# EAGLE design Body_PCB_v1 (EAGLE 7.2.0)

## Sheet 1 of 2
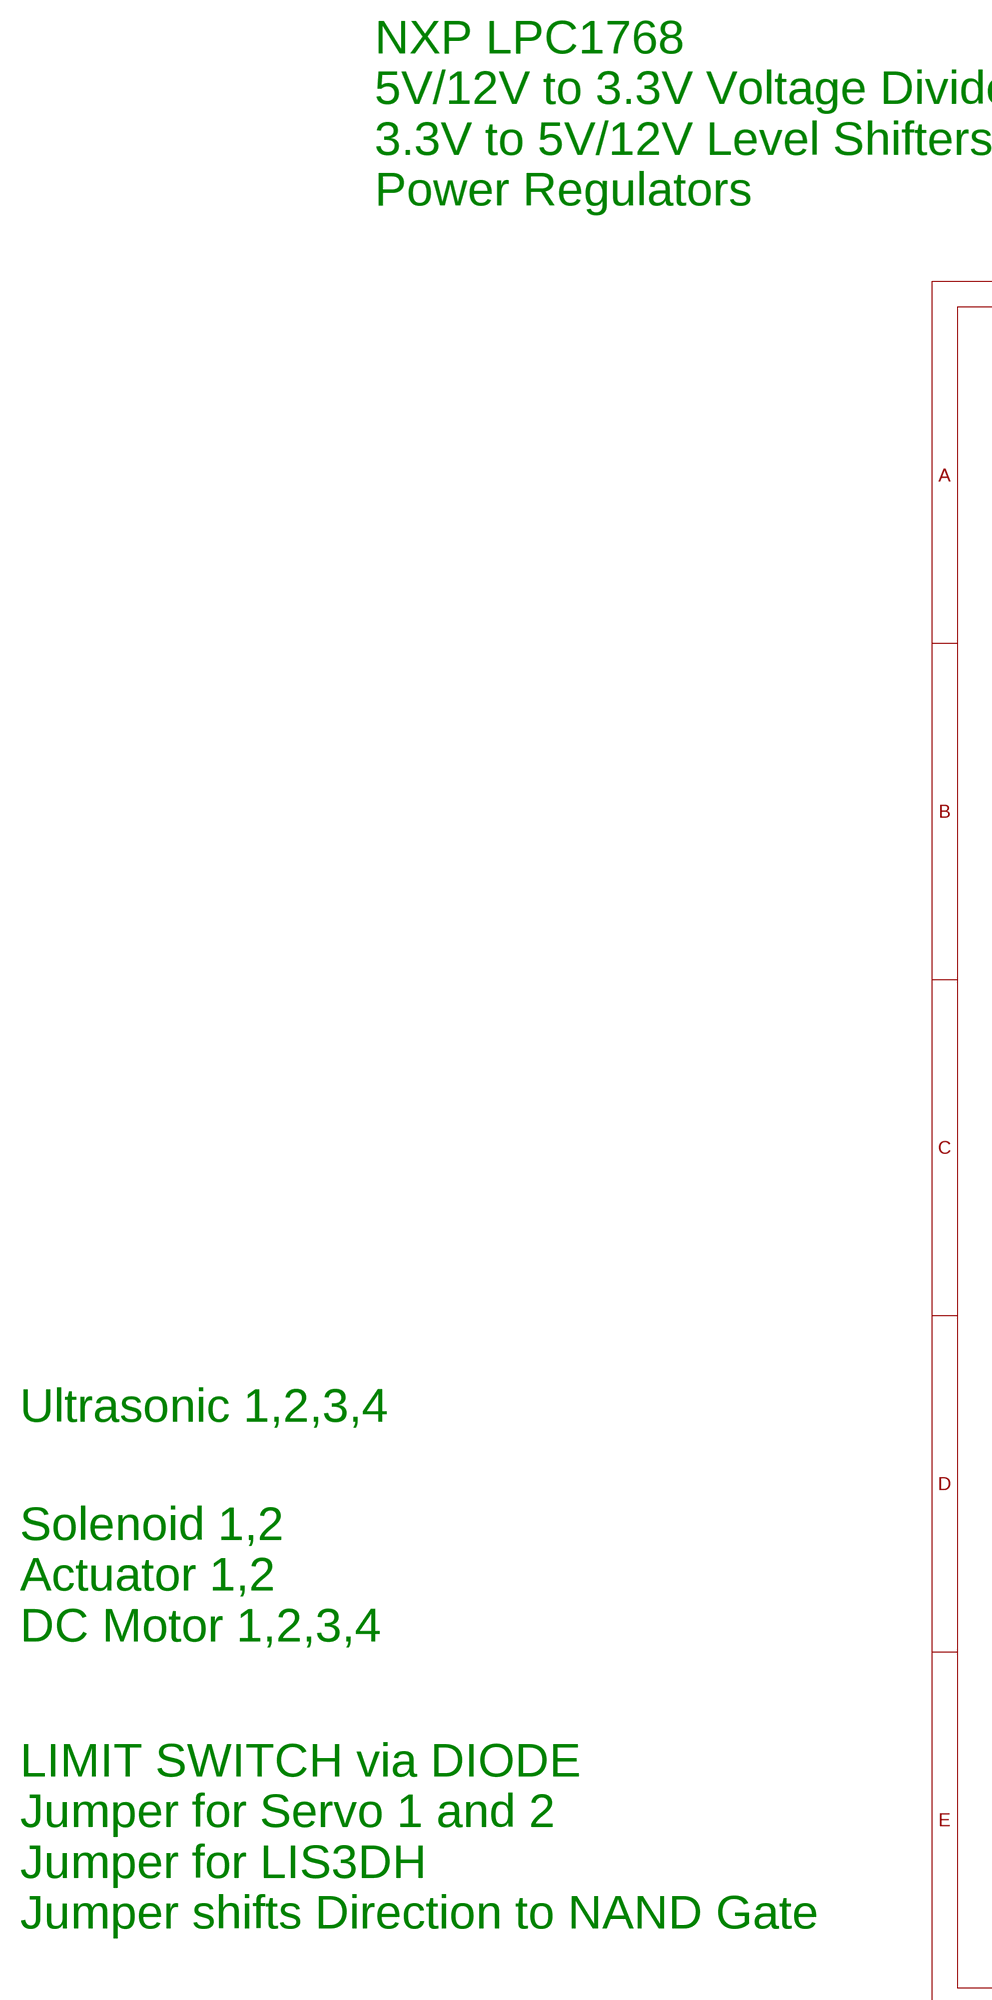
[diagram p0: schematic, sheet 1, part 1 of 2]
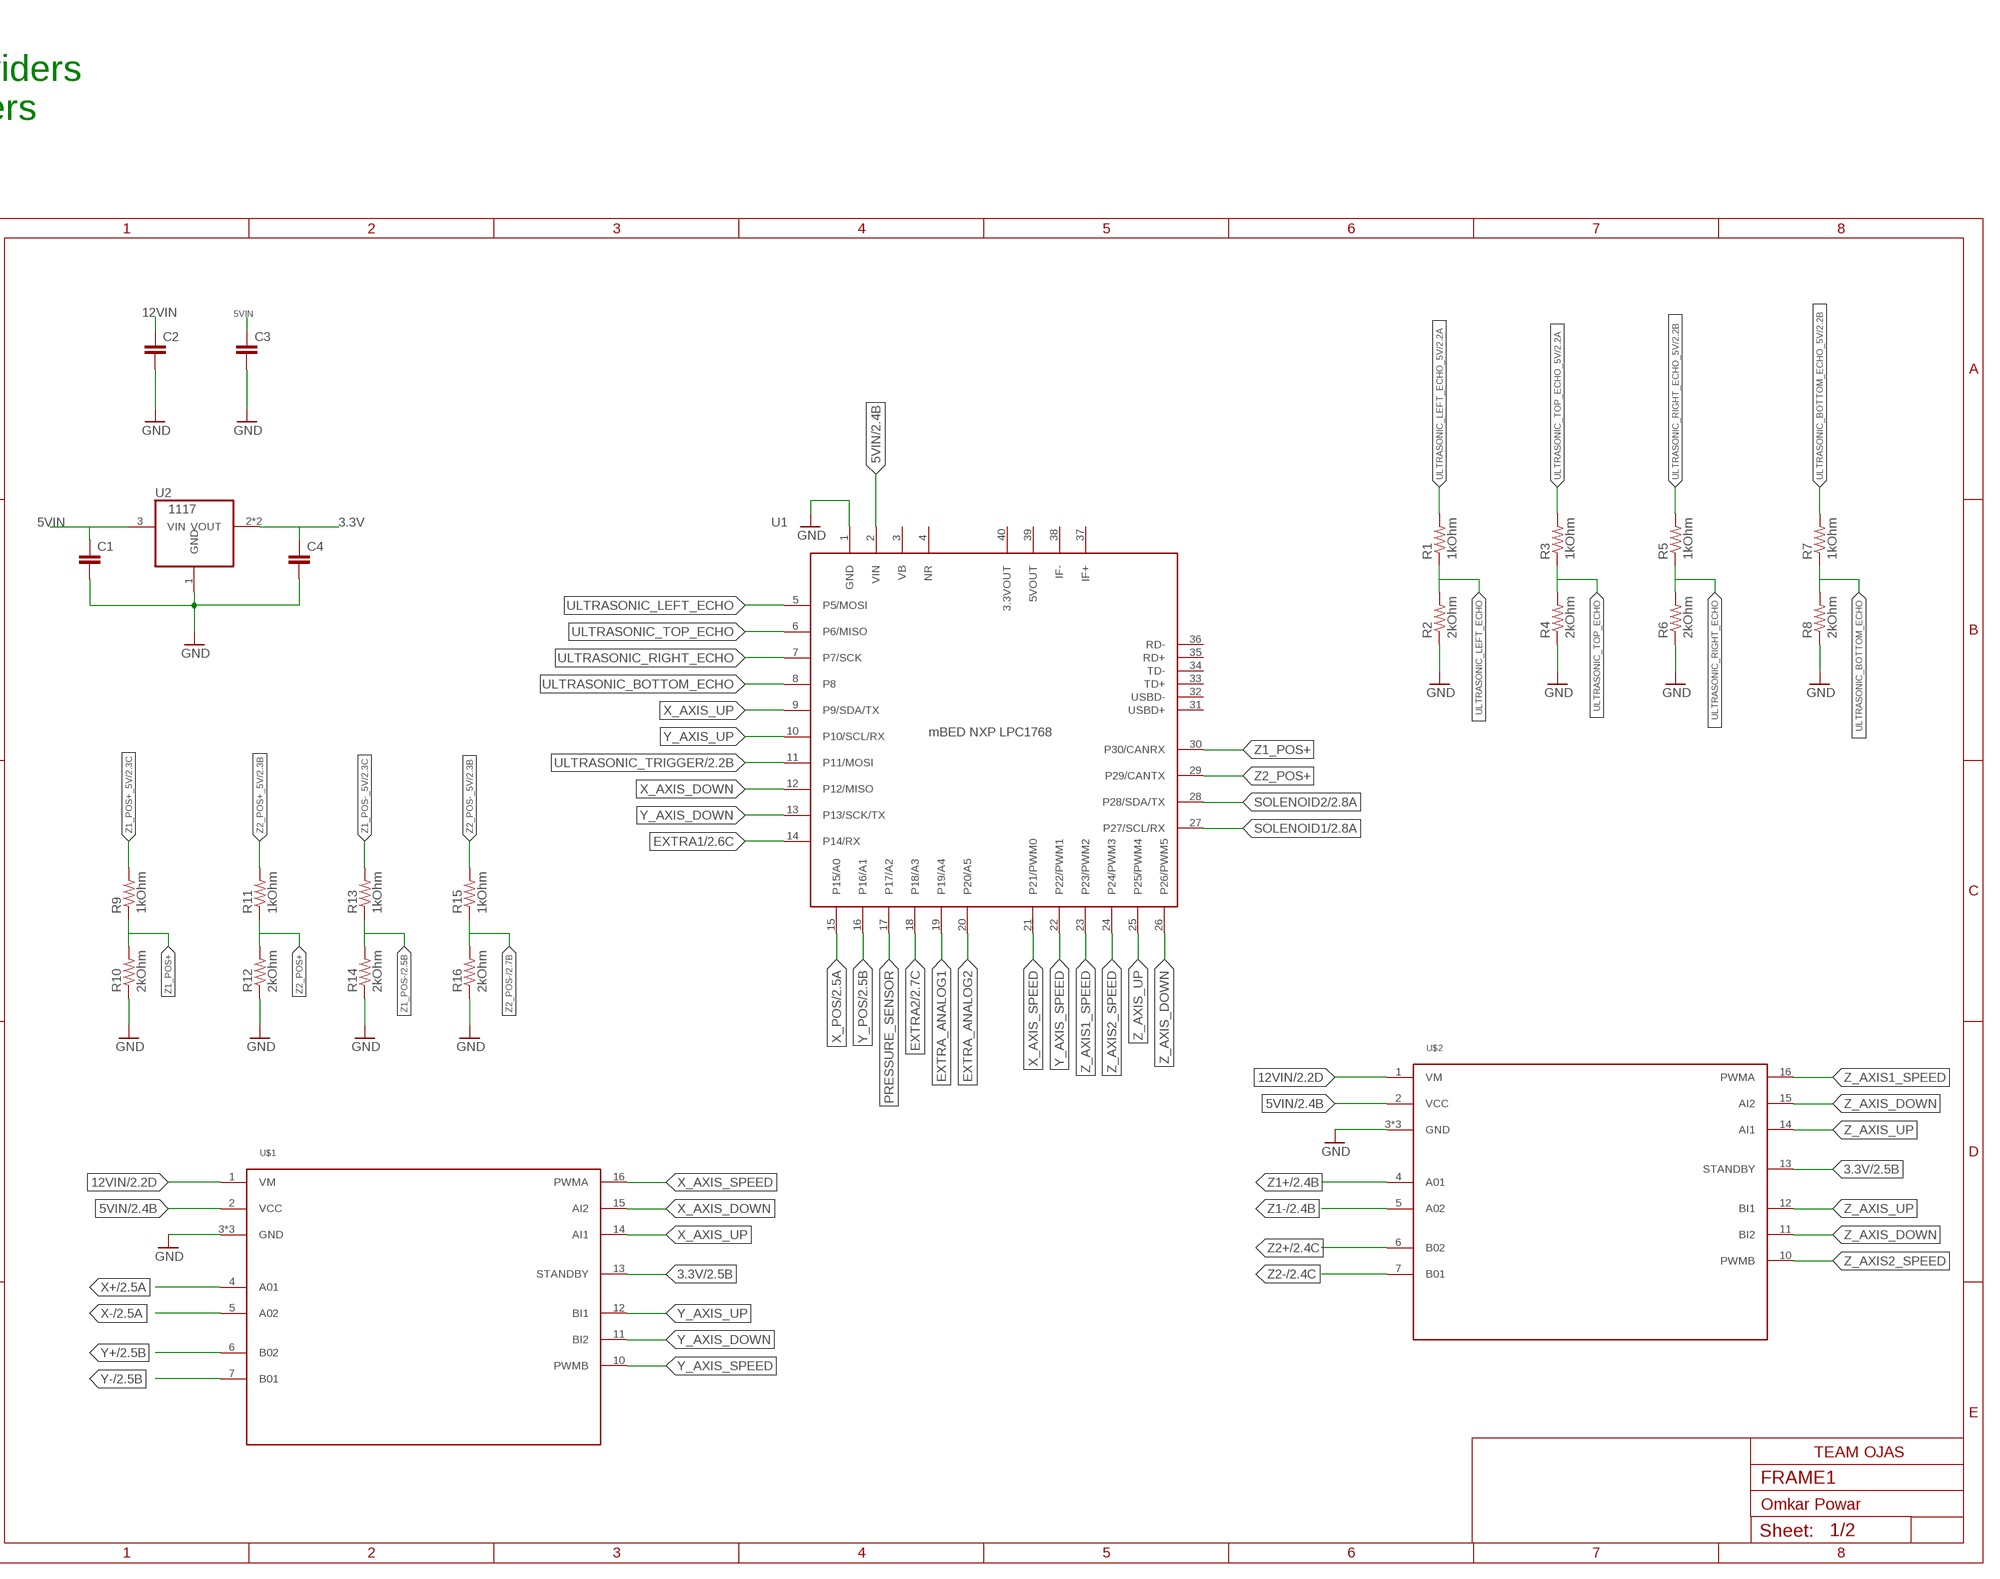
[diagram p1: schematic, sheet 1, part 2 of 2]

### Parts
C1  C1206  [1206]
C2  C1206  [1206]
C3  C1206  [1206]
C4  C1206  [1206]
R1  1kOhm  R0805  [0805]
R2  2kOhm  R0805  [0805]
R3  1kOhm  R0805  [0805]
R4  2kOhm  R0805  [0805]
R5  1kOhm  R0805  [0805]
R6  2kOhm  R0805  [0805]
R7  1kOhm  R0805  [0805]
R8  2kOhm  R0805  [0805]
R9  1kOhm  R0805  [0805]
R10  2kOhm  R0805  [0805]
R11  1kOhm  R0805  [0805]
R12  2kOhm  R0805  [0805]
R13  1kOhm  R0805  [0805]
R14  2kOhm  R0805  [0805]
R15  1kOhm  R0805  [0805]
R16  2kOhm  R0805  [0805]
U1  MBED_NXP_LPC1768  [40_PDIP]
U2  1117  [SOT223]
U$1  TB6612FNG  [TB6612FNG_DRIVER]
U$2  TB6612FNG  [TB6612FNG_DRIVER]

### Nets
3.3V: C4.1 U2.2(VOUT) U2.4(VOUT) U$1.13(STANDBY) U$2.13(STANDBY) ; also sheet 2
5VIN: C1.1 C3.1 U1.2(VIN) U2.3(VIN) U$1.2(VCC) U$2.2(VCC) ; also sheet 2
12VIN: C2.1 U$1.1(VM) U$2.1(VM) ; also sheet 2
EXTRA1: U1.14(P14/RX) ; also sheet 2
EXTRA2: U1.18(P18/A3) ; also sheet 2
EXTRA_ANALOG1: U1.19(P19/A4)
EXTRA_ANALOG2: U1.20(P20/A5)
GND: C1.2 C2.2 C3.2 C4.2 R2.P$1 R4.P$1 R6.P$1 R8.P$1 R10.P$1 R12.P$1 R14.P$1 R16.P$1 U1.1(GND) U2.1(GND) U$1.3(GND) U$1.8(GND) U$1.9(GND) U$2.3(GND) U$2.8(GND) U$2.9(GND) ; also sheet 2
PRESSURE_SENSOR: U1.17(P17/A2)
SOLENOID1: U1.27(P27/SCL/RX) ; also sheet 2
SOLENOID2: U1.28(P28/SDA/TX) ; also sheet 2
ULTRASONIC_BOTTOM_ECHO: R7.P$1 R8.P$2 U1.8
ULTRASONIC_BOTTOM_ECHO_5V: R7.P$2 ; also sheet 2
ULTRASONIC_LEFT_ECHO: R1.P$1 R2.P$2 U1.5(P5/MOSI)
ULTRASONIC_LEFT_ECHO_5V: R1.P$2 ; also sheet 2
ULTRASONIC_RIGHT_ECHO: R5.P$1 R6.P$2 U1.7(P7/SCK)
ULTRASONIC_RIGHT_ECHO_5V: R5.P$2 ; also sheet 2
ULTRASONIC_TOP_ECHO: R3.P$1 R4.P$2 U1.6(P6/MISO)
ULTRASONIC_TOP_ECHO_5V: R3.P$2 ; also sheet 2
ULTRASONIC_TRIGGER: U1.11(P11/MOSI) ; also sheet 2
X+: U$1.4(A01) ; also sheet 2
X-: U$1.5(A02) ; also sheet 2
X_AXIS_DOWN: U1.12(P12/MISO) U$1.15(AI2)
X_AXIS_SPEED: U1.21(P21/PWM0) U$1.16(PWMA)
X_AXIS_UP: U1.9(P9/SDA/TX) U$1.14(AI1)
X_POS: U1.15(P15/A0) ; also sheet 2
Y+: U$1.6(B02) ; also sheet 2
Y-: U$1.7(B01) ; also sheet 2
Y_AXIS_DOWN: U1.13(P13/SCK/TX) U$1.11(BI2)
Y_AXIS_SPEED: U1.22(P22/PWM1) U$1.10(PWMB)
Y_AXIS_UP: U1.10(P10/SCL/RX) U$1.12(BI1)
Y_POS: U1.16(P16/A1) ; also sheet 2
Z1+: U$2.4(A01) ; also sheet 2
Z1-: U$2.5(A02) ; also sheet 2
Z1_POS+: R9.P$1 R10.P$2 U1.30(P30/CANRX)
Z1_POS+_5V: R9.P$2 ; also sheet 2
Z1_POS-: R13.P$1 R14.P$2 ; also sheet 2
Z1_POS-_5V: R13.P$2 ; also sheet 2
Z2+: U$2.6(B02) ; also sheet 2
Z2-: U$2.7(B01) ; also sheet 2
Z2_POS+: R11.P$1 R12.P$2 U1.29(P29/CANTX)
Z2_POS+_5V: R11.P$2 ; also sheet 2
Z2_POS-: R15.P$1 R16.P$2 ; also sheet 2
Z2_POS-_5V: R15.P$2 ; also sheet 2
Z_AXIS1_SPEED: U1.23(P23/PWM2) U$2.16(PWMA)
Z_AXIS2_SPEED: U1.24(P24/PWM3) U$2.10(PWMB)
Z_AXIS_DOWN: U1.26(P26/PWM5) U$2.11(BI2) U$2.15(AI2)
Z_AXIS_UP: U1.25(P25/PWM4) U$2.12(BI1) U$2.14(AI1)
Unconnected: U1.3(VB) U1.4(NR) U1.31(USBD+) U1.32(USBD-) U1.33(TD+) U1.34(TD-) U1.35(RD+) U1.36(RD-) U1.37(IF+) U1.38(IF-) U1.39(5VOUT) U1.40(3.3VOUT)

### Notes on the sheet
- NXP LPC1768
  5V/12V to 3.3V Voltage Dividers
  3.3V to 5V/12V Level Shifters
  Power Regulators
- Ultrasonic 1,2,3,4
- Solenoid 1,2
  Actuator 1,2
  DC Motor 1,2,3,4
- LIMIT SWITCH via DIODE
  Jumper for Servo 1 and 2
  Jumper for LIS3DH
  Jumper shifts Direction to NAND Gate

## Sheet 2 of 2
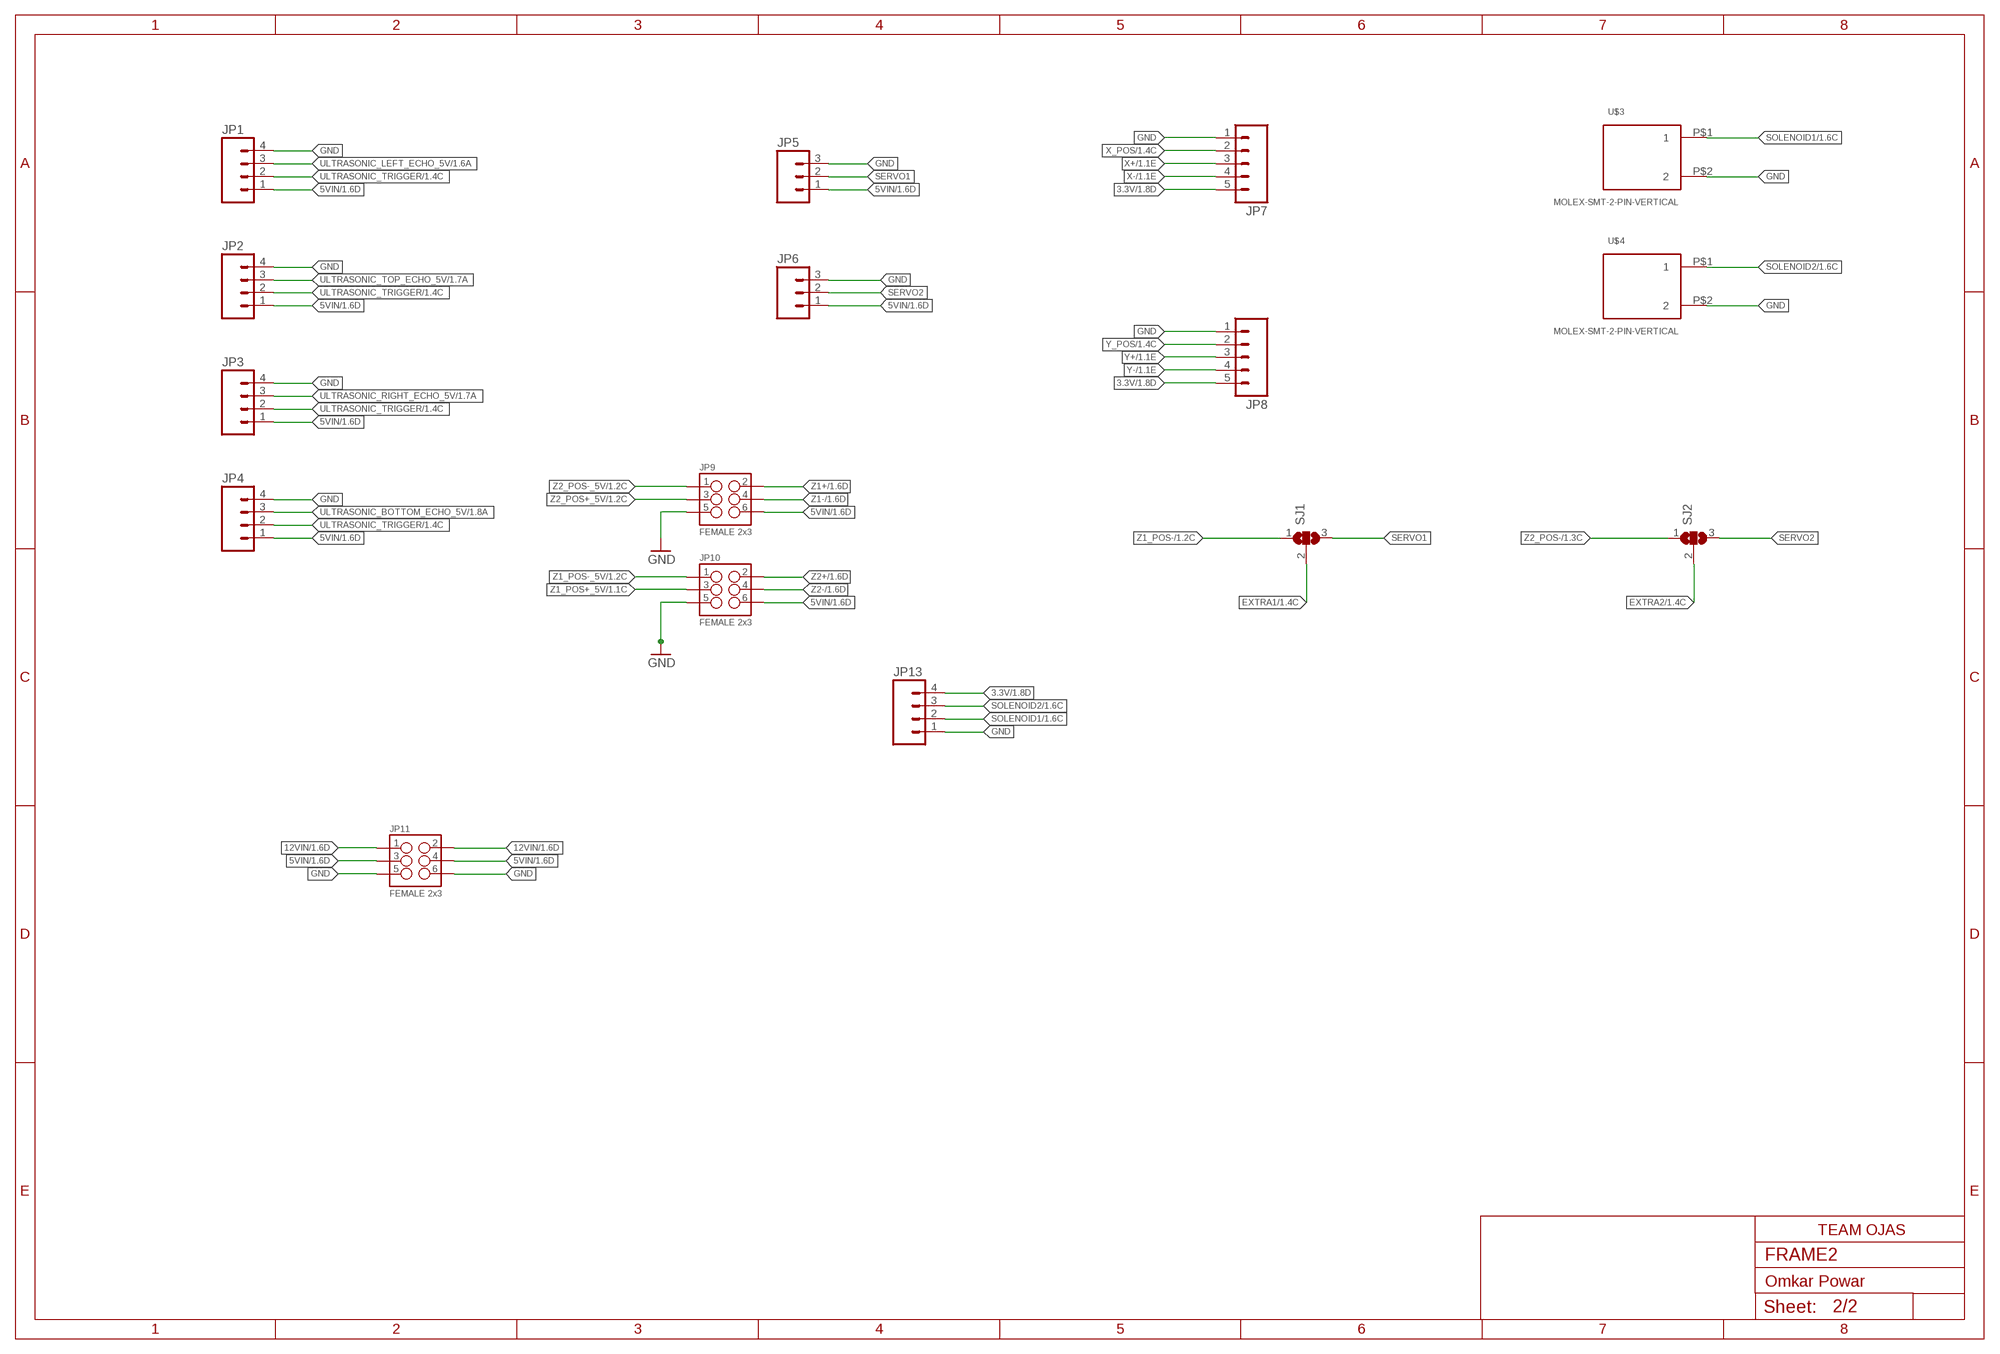
[diagram p2: schematic, sheet 2]

### Parts
JP1  M04PTH  [1X04]
JP2  M04PTH  [1X04]
JP3  M04PTH  [1X04]
JP4  M04PTH  [1X04]
JP5  M03PTH  [1X03]
JP6  M03PTH  [1X03]
JP7  M05PTH  [1X05]
JP8  M05PTH  [1X05]
JP9  FEMALE 2x3  M03X2FEMALE  [2X3]
JP10  FEMALE 2x3  M03X2FEMALE  [2X3]
JP11  FEMALE 2x3  M03X2FEMALE  [2X3]
JP13  M04PTH  [1X04]
SJ1  SJ2W  [SJ_2]
SJ2  SJ2W  [SJ_2]
U$3  MOLEX-SMT-2-PIN-VERTICAL  [430450215]
U$4  MOLEX-SMT-2-PIN-VERTICAL  [430450215]

### Nets
3.3V: JP7.5 JP8.5 JP13.4 ; also sheet 1
5VIN: JP1.1 JP2.1 JP3.1 JP4.1 JP5.1 JP6.1 JP9.6 JP10.6 JP11.3 JP11.4 ; also sheet 1
12VIN: JP11.1 JP11.2 ; also sheet 1
EXTRA1: SJ1.2 ; also sheet 1
EXTRA2: SJ2.2 ; also sheet 1
GND: JP1.4 JP2.4 JP3.4 JP4.4 JP5.3 JP6.3 JP7.1 JP8.1 JP9.5 JP10.5 JP11.5 JP11.6 JP13.1 U$3.P$2 U$4.P$2 ; also sheet 1
SERVO1: JP5.2 SJ1.3
SERVO2: JP6.2 SJ2.3
SOLENOID1: JP13.2 U$3.P$1 ; also sheet 1
SOLENOID2: JP13.3 U$4.P$1 ; also sheet 1
ULTRASONIC_BOTTOM_ECHO_5V: JP4.3 ; also sheet 1
ULTRASONIC_LEFT_ECHO_5V: JP1.3 ; also sheet 1
ULTRASONIC_RIGHT_ECHO_5V: JP3.3 ; also sheet 1
ULTRASONIC_TOP_ECHO_5V: JP2.3 ; also sheet 1
ULTRASONIC_TRIGGER: JP1.2 JP2.2 JP3.2 JP4.2 ; also sheet 1
X+: JP7.3 ; also sheet 1
X-: JP7.4 ; also sheet 1
X_POS: JP7.2 ; also sheet 1
Y+: JP8.3 ; also sheet 1
Y-: JP8.4 ; also sheet 1
Y_POS: JP8.2 ; also sheet 1
Z1+: JP9.2 ; also sheet 1
Z1-: JP9.4 ; also sheet 1
Z1_POS+_5V: JP10.3 ; also sheet 1
Z1_POS-: SJ1.1 ; also sheet 1
Z1_POS-_5V: JP10.1 ; also sheet 1
Z2+: JP10.2 ; also sheet 1
Z2-: JP10.4 ; also sheet 1
Z2_POS+_5V: JP9.3 ; also sheet 1
Z2_POS-: SJ2.1 ; also sheet 1
Z2_POS-_5V: JP9.1 ; also sheet 1

## Library data of the parts
C1-C4 = Team_Ojas_OVPowar:C
JP1-JP4 JP13 = SparkFun-Connectors:M04: Header 4 Standard 4-pin 0.1" header. Use with straight break away headers (SKU : PRT-00116), right angle break away headers (PRT-00553), swiss pins (PRT-00743), machine pins (PRT-00117), and female headers (PRT-00115). Molex polarized connector foot print use with SKU : PRT-08231 with associated crimp pins and housings. 1MM SMD Version SKU: PRT-10208
JP5 JP6 = SparkFun-Connectors:M03: Header 3 Standard 3-pin 0.1" header. Use with straight break away headers (SKU : PRT-00116), right angle break away headers (PRT-00553), swiss pins (PRT-00743), machine pins (PRT-00117), and female headers (PRT-00115). Molex polarized connector foot print use with SKU : PRT-08232 with associated crimp pins and housings.
JP7 JP8 = SparkFun-Connectors:M05: Header 5 Standard 5-pin 0.1" header. Use with straight break away headers (SKU : PRT-00116), right angle break away headers (PRT-00553), swiss pins (PRT-00743), machine pins (PRT-00117), and female headers (PRT-00115). Molex polarized connector foot print use with SKU : PRT-08230 with associated crimp pins and housings.
JP9-JP11 = SparkFun-Connectors:M03X2: 2x3 .1" header. Shrouded, with keying- CONN-10681 SMT- CONN-11415 Pogo pins- HW-11044; PROD_ID: CONN-11566
R1-R16 = Team_Ojas_OVPowar:R
SJ1 SJ2 = jumper:SJ2W: SMD solder JUMPER
U1 = Team_Ojas_OVPowar:MBED_NXP_LPC1768
U2 = Carnot_AfterMarket_v2.2:1117
U$1 U$2 = Team_Ojas_OVPowar:TB6612FNG
U$3 U$4 = Team_Ojas_OVPowar:MOLEX-SMT-2-PIN-VERTICAL

## Board
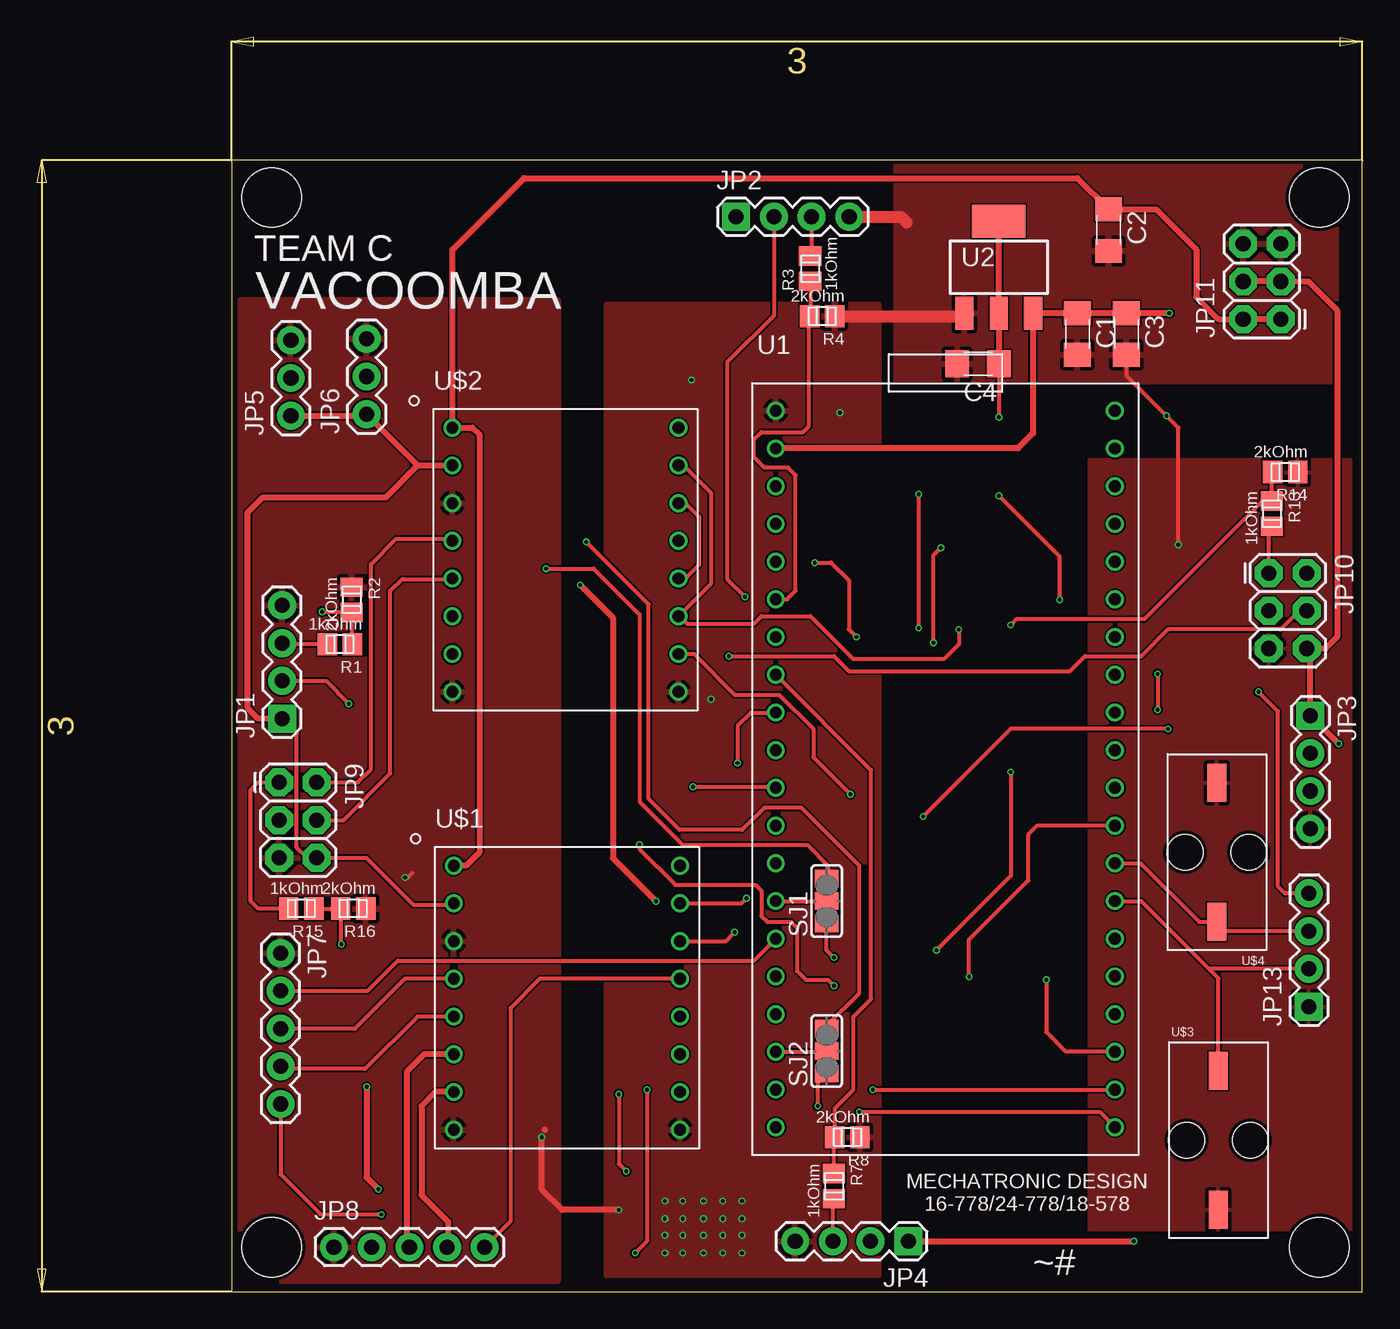
[diagram p3: board, top side]
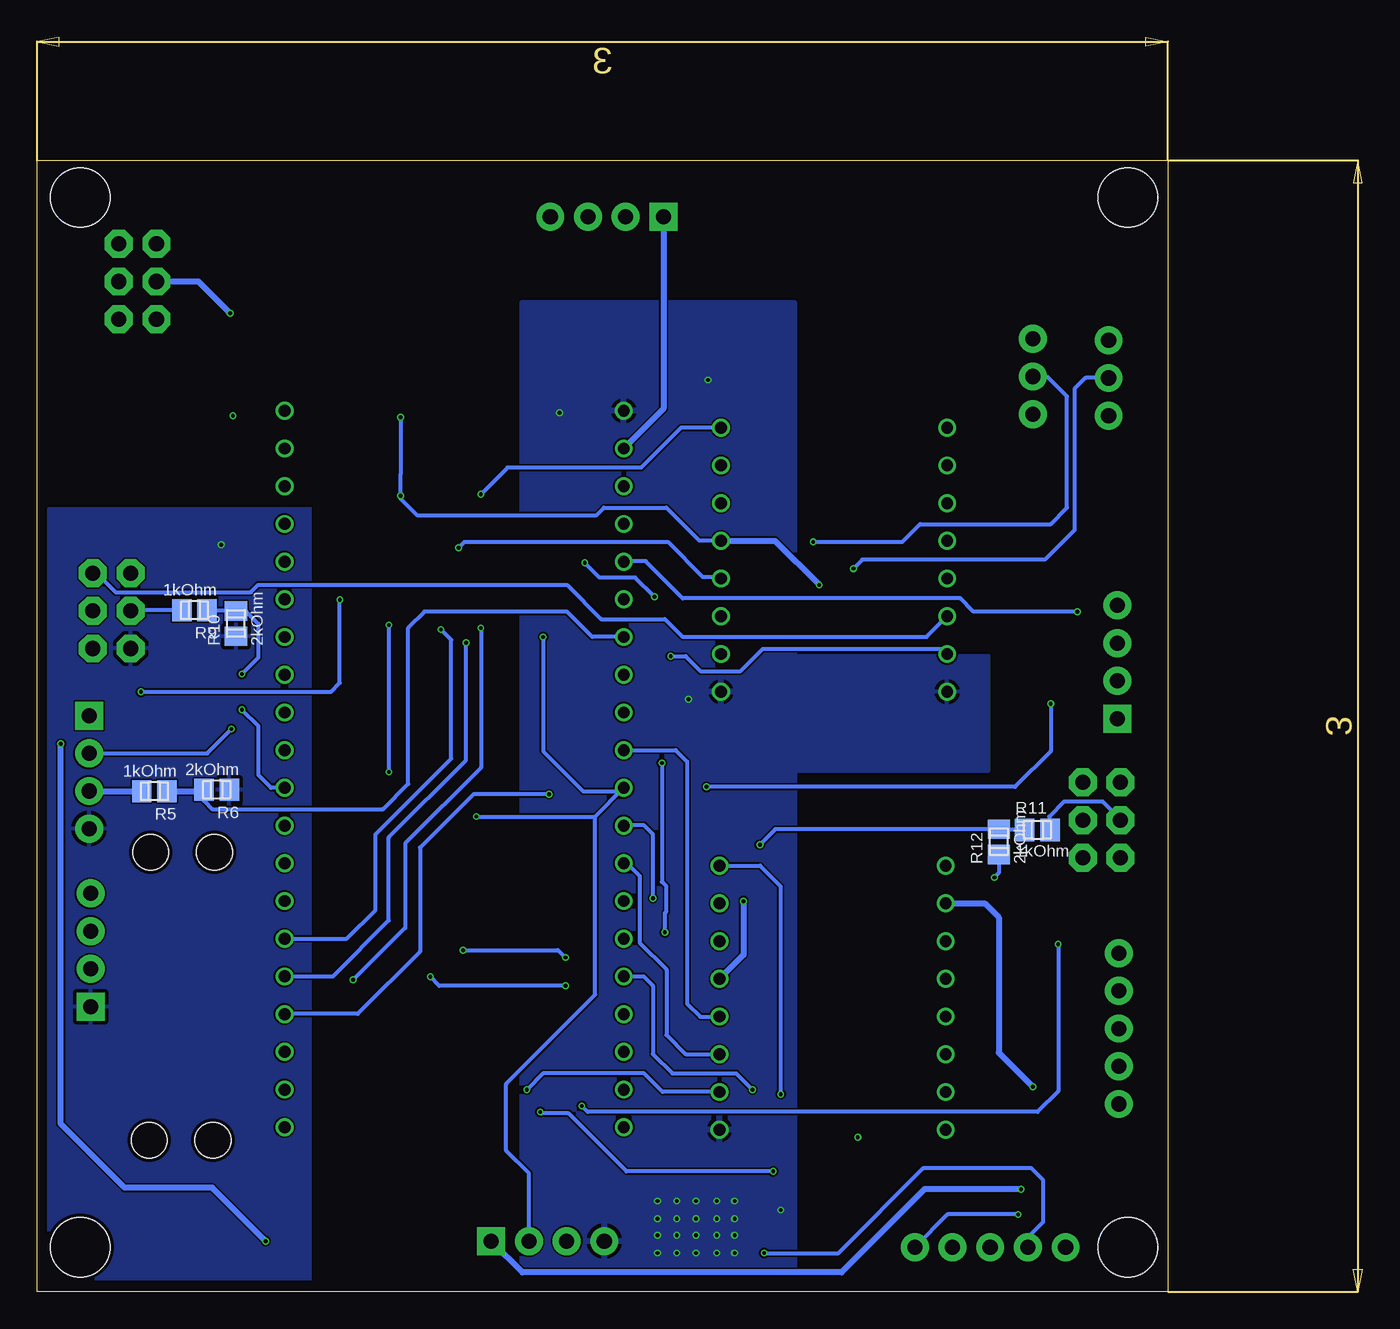
[diagram p4: board, bottom side, seen from below]

Size 76.2 x 76.2 mm. Coordinates in mm from the lower left corner, seen from the top.
Outline: 0,0 76.2,0 76.2,76.2 0,76.2 0,0
Copper layers (1*16): Top 0.035mm / dielectric 1.5mm / Bottom 0.035mm
Design rules "Carnot_syrma": minimum track width 0.1mm, minimum drill 0.2mm, track to track 0.12mm, track to pad 0.12mm, pad to pad 0.12mm, via to via 0.35mm, smd to smd 0.23mm, copper to edge 0.25mm, drill to drill 0.2mm, minimum pad ring 6mil, minimum via ring 4mil, stop-mask expansion 0.05mm, vias tented up to drill 0mil, thermal gap 10mil
Holes 4 mm at 2.7,73.7 73.3,73.7 2.7,3 73.3,3

### Footprints (pad centres in the part's own frame; a part is rotated, then mirrored left to right if it is on the bottom)
1206 = smd 1.6 x 1.8: 1 -1.4,0; 2 1.4,0
1X04 = drill 1.016 pad 1.88 square: 1 0,0 | drill 1.016 pad 1.88: 2 2.54,0; 3 5.08,0; 4 7.62,0
1X03 = drill 1.016 pad 1.88: 1 0,0; 2 2.54,0; 3 5.08,0
1X05 = drill 1.016 pad 1.88: 1 0,0; 2 2.54,0; 3 5.08,0; 4 7.62,0; 5 10.16,0
2X3 = drill 1.016 pad 1.88 octagon: 1 0,0; 2 0,2.54; 3 2.54,0; 4 2.54,2.54; 5 5.08,0; 6 5.08,2.54
0805 = smd 1.3 x 1.5: P$1 -0.85,0; P$2 0.85,0
SJ_2 = smd 1.168 x 1.6: 1 -1.524,0; 2 0,0; 3 1.524,0
40_PDIP = drill 0.8: 1 -11.43,24.13; 2 -11.43,21.59; 3 -11.43,19.05; 4 -11.43,16.51; 5 -11.43,13.97; 6 -11.43,11.43; 7 -11.43,8.89; 8 -11.43,6.35; 9 -11.43,3.81; 10 -11.43,1.27; 11 -11.43,-1.27; 12 -11.43,-3.81; 13 -11.43,-6.35; 14 -11.43,-8.89; 15 -11.43,-11.43; 16 -11.43,-13.97; 17 -11.43,-16.51; 18 -11.43,-19.05; 19 -11.43,-21.59; 20 -11.43,-24.13; 21 11.43,-24.13; 22 11.43,-21.59; 23 11.43,-19.05; 24 11.43,-16.51; 25 11.43,-13.97; 26 11.43,-11.43; 27 11.43,-8.89; 28 11.43,-6.35; 29 11.43,-3.81; 30 11.43,-1.27; 31 11.43,1.27; 32 11.43,3.81; 33 11.43,6.35; 34 11.43,8.89; 35 11.43,11.43; 36 11.43,13.97; 37 11.43,16.51; 38 11.43,19.05; 39 11.43,21.59; 40 11.43,24.13
SOT223 = smd 1.219 x 2.235: 1 -2.311,-3.099; 2 0,-3.099; 3 2.311,-3.099 | smd 3.6 x 2.2: 4 0,3.099
TB6612FNG_DRIVER = drill 0.8: 1 -7.62,8.89; 2 -7.62,6.35; 3 -7.62,3.81; 4 -7.62,1.27; 5 -7.62,-1.27; 6 -7.62,-3.81; 7 -7.62,-6.35; 8 -7.62,-8.89; 9 7.62,-8.89; 10 7.62,-6.35; 11 7.62,-3.81; 12 7.62,-1.27; 13 7.62,1.27; 14 7.62,3.81; 15 7.62,6.35; 16 7.62,8.89
430450215 = smd 1.27 x 2.54: P$1 0,4.68; P$2 0,-4.68 | hole 2.41: -2.15,0; 2.15,0

### Placement (x,y rotation side)
C1  57,64.5 270 top
C2  59.1,71.5 270 top
C3  60.3,64.5 270 top
C4  50.3,62.5 180 top
JP1  3.4,38.6 90 top
JP2  34,72.4 0 top
JP3  72.7,38.8 270 top
JP4  45.6,3.4 180 top
JP5  4,59 90 top
JP6  9.1,59.1 90 top
JP7  3.3,22.8 270 top
JP8  6.9,3 0 top
JP9  3.2,34.3 270 top
JP10  69.9,48.4 270 top
JP11  70.7,65.5 90 top
JP13  72.6,19.2 90 top
R1  7.3,43.6 180 top
R2  8.1,46.6 270 top
R3  39,68.9 90 top
R4  39.8,65.7 180 top
R5  68.3,33.7 180 bottom
R6  64.1,33.8 180 bottom
R7  40.6,7.1 270 top
R8  41.5,10.4 180 top
R9  65.6,45.9 180 bottom
R10  62.8,45 90 bottom
R11  8.8,31.1 0 bottom
R12  11.4,30.3 90 bottom
R13  70.1,52.4 270 top
R14  71,55.2 180 top
R15  4.7,25.8 180 top
R16  8.2,25.8 180 top
SJ1  40.1,26.3 90 top
SJ2  40.1,16.2 90 top
U1  48.1,35.2 0 top
U2  51.7,69 0 top
U$1  22.6,19.8 0 top
U$2  22.5,49.3 0 top
U$3  66.5,10.2 0 top
U$4  66.4,29.6 180 top

### Tracks (layer width: path | path; a pad name or v marks a point on that pad's centre or on a via)
3.3V  (via drill 0.25)
  Top 0.254: JP7.5 3.3,7.9 6,5.2 v10.1,5.2 | U$1.13 20.77,21.07 18.8,19.1 18.8,4.74 JP8.5 | C4.1 v51.7,58.9 | JP13.4 70.98,26.82 70.5,27.3 70.5,39.1 v69.2,40.4 | v55.8,46.6 55.8,49.5 v51.7,53.6
  Top 0.406: U2.4 U2.2 C4.1 | v23.5,47.6 25.7,45.4 25.7,29.2 v28.6,26.3
  Bottom 0.254: v10.1,5.2 14.86,5.2 JP8.5 | v51.7,58.9 51.7,55.1 v51.7,53.6 51.7,53.4 50.6,52.3 38.5,52.3 38,52.8 33.8,52.8 31.6,50.6 30.15,50.6 U$2.13 | v69.2,40.4 56.4,40.4 55.8,41 v55.8,46.6
  Bottom 0.406: U$2.13 26.47,50.57 v23.5,47.6 | v28.6,26.3 28.6,22.69 U$1.13
5VIN  (via drill 0.25)
  Top 0.254: C1.1 | JP9.6 9.08,29.22 12.25,26.05 14.88,26.05 U$1.2 | 5.18,29.22 5.08,29.22 4.4,29.9 4.4,37.6 JP1.1
  Top 0.406: JP11.4 JP11.3 72.56,68.04 74.5,66.1 74.5,44.1 73.7,43.3 72.46,43.3 JP10.6 72.7,43.06 JP3.1 v74.6,36.9 | JP5.1 9,59 JP6.1 12.55,55.65 | v63.2,65.9 C3.1 C1.1 | C1.1 U2.3 54.01,57.81 53,56.8 U1.2 | JP4.1 v60.8,3.4 | v9.1,13.8 9.1,7.7 v9.9,6.9 | 12.55,55.65 U$2.2 | JP1.1 1.8,38.6 1.1,39.3 1.1,52.5 2.1,53.5 10.4,53.5 12.55,55.65 | JP9.6 5.18,29.22
  Bottom 0.406: JP11.4 65.34,68.04 v63.2,65.9 | U$1.2 12.35,26.15 11.4,25.2 11.4,16.1 v9.1,13.8 | v9.9,6.9 16.4,6.9 22,1.3 43.5,1.3 JP4.1 | JP2.1 34,59.46 U1.2 | v60.8,3.4 64.4,7 70.3,7 74.6,11.3 v74.6,36.9
12VIN
  Top 0.406: JP11.1 JP11.2 66.5,65.5 65,67 65,70.2 62.3,72.9 C2.1 57,75 19.7,75 14.88,70.18 U$2.1 16.21,58.19 16.7,57.7 16.7,29.6 15.8,28.7 U$1.1
EXTRA1
  Top 0.254: U1.14 SJ1.2
EXTRA2
  Top 0.254: U1.18 40.05,16.15 SJ2.2
GND  (via drill 0.25)
  Top 0.254: v11.7,27.9 11.9,27.9 12.2,28.2 | C3.2 60.3,61.7 v63,59 63.8,58.2 v63.8,50.3
  Top 0.406: 21.11,10.91 21.1,10.9 | v26.1,5.5 22.3,5.5 20.9,6.9 v20.9,10.4
  Top 0.813: R4.P$1 49.19,65.7 U2.1 | JP2.4 45.1,72.4 45.5,72
  Bottom 0.254: R12.P$1 11.4,28.2 v11.7,27.9
  other vias: 32.3,39.9 41,59.2 31,61.4 29.2,2.6 30.4,2.6 31.8,2.6 33.1,2.6 34.4,2.6 29.2,3.8 30.4,3.8 31.8,3.8 33.1,3.8 34.4,3.8 29.2,4.9 30.4,4.9 31.8,4.9 33.1,4.9 34.4,4.9 29.2,6.1 30.4,6.1 31.8,6.1 33.1,6.1 34.4,6.1
  pour Top: 44.8,78.9 74.4,78.9 74.4,61.3 44.8,61.3
  pour Top: 22,66.8 22,0.7 0.6,0.7 0.6,66.8
  pour Top: 25.3,66.5 43.6,66.5 43.6,1.1 25.3,1.1
  pour Bottom: 57.8,52.7 75.4,52.7 75.4,0.9 57.8,0.9
  pour Top: 75.4,56 57.8,56 57.8,4.2 75.4,4.2
  pour Bottom: 12.1,42.8 33.4,42.8 33.4,35.1 12.1,35.1
  pour Bottom: 43.5,66.6 25.2,66.6 25.2,1.2 43.5,1.2
SERVO1  (via drill 0.25)
  Top 0.254: v21.2,48.7 24.4,48.7 27.5,45.6 27.5,33 30.4,30.1 38.8,30.1 40.2,28.7 40.2,27.92 SJ1.3
  Bottom 0.254: JP5.2 5.56,61.54 6.3,60.8 6.3,51.3 8.3,49.3 20.6,49.3 v21.2,48.7
SERVO2  (via drill 0.25)
  Top 0.254: SJ2.3 40.1,17.9 42.3,20.1 42.3,28.7 38.4,32.6 35.9,32.6 34.4,31.1 30.2,31.1 28.1,33.2 28.1,46.3 v23.9,50.5
  Bottom 0.254: v23.9,50.5 17.9,50.5 16.7,51.7 7.9,51.7 6.8,52.8 6.8,60.3 8.1,61.6 9.06,61.6 JP6.2
SOLENOID1
  Top 0.254: U1.27 61.29,26.31 65.86,21.74 | JP13.2 65.86,21.74 | U$3.P$1 66.5,21.1 65.86,21.74
SOLENOID2
  Top 0.254: U1.28 61.25,28.85 65.2,24.9 66.38,24.9 U$4.P$1 67.04,24.28 JP13.3
ULTRASONIC_BOTTOM_ECHO
  Top 0.254: R7.P$1 40.6,10.35 R8.P$2 40.65,12.35 41.9,13.6 41.9,18.5 43.1,19.7 43.1,35.12 U1.8
ULTRASONIC_BOTTOM_ECHO_5V
  Top 0.254: JP4.3 40.52,6.17 R7.P$2
ULTRASONIC_LEFT_ECHO  (via drill 0.25)
  Top 0.254: R1.P$1 8.1,43.65 R2.P$2 6.15,45.75 v6.1,45.8
  Bottom 0.254: v6.1,45.8 13.1,45.8 14,46.7 32.7,46.7 35.2,49.2 36.64,49.2 U1.5
ULTRASONIC_LEFT_ECHO_5V
  Top 0.254: R1.P$2 3.48,43.6 JP1.3
ULTRASONIC_RIGHT_ECHO
  Bottom 0.254: R6.P$2 64.95,33.05 64.4,32.5 52.9,32.5 51.2,34.2 51.2,44.7 50.1,45.8 40.5,45.8 38.8,44.1 U1.7
  Bottom 0.406: R5.P$1 65.05,33.7 R6.P$2
ULTRASONIC_RIGHT_ECHO_5V
  Bottom 0.406: JP3.3 69.17,33.72 R5.P$2
ULTRASONIC_TOP_ECHO
  Top 0.254: R3.P$1 39,66.2 | 39,66.2 39,65.75 R4.P$2 | U1.6 37.43,46.63 38,47.2 38,55 37.5,55.5 35.9,55.5 35.2,56.2 35.2,57.4 35.7,57.9 38.5,57.9 38.9,58.3 38.9,66.1 39,66.2
ULTRASONIC_TOP_ECHO_5V
  Top 0.254: JP2.3 39.08,69.83 R3.P$2
ULTRASONIC_TRIGGER  (via drill 0.25)
  Top 0.254: JP1.2 6.36,41.14 v7.9,39.6 | v31.1,34 36.6,34 U1.11 | v63.1,37.9 52.5,37.9 v46.6,32 | JP2.2 36.54,65.74 33.4,62.6 33.4,48 v34.6,46.8 34.4,47 | v39.3,49.1 40.4,49.1 41.6,47.9 41.6,44.6 v42.1,44.1
  Bottom 0.254: v7.9,39.6 7.9,36.4 10.3,34 v31.1,34 | JP4.2 43.06,7.96 44.6,9.5 44.6,14 38.6,20 38.6,32 | 36.7,33.9 U1.11 | 38.6,32 U1.11 | 36.6,34 U1.11 | JP3.2 64.74,36.26 v63.1,37.9 | v46.6,32 38.6,32 | v34.6,46.8 35.9,48.1 38.3,48.1 v39.3,49.1 | v42.1,44.1 42.1,36.4 39.4,33.7 36.9,33.7 U1.11
X+
  Top 0.254: U$1.4 11.67,21.07 8.3,17.7 3.32,17.7 JP7.3
X-
  Top 0.254: U$1.5 12.53,18.53 9,15 3.48,15 JP7.4
X_AXIS_DOWN  (via drill 0.25)
  Top 0.254: U$1.15 34.35,26.15 v34.7,26.5
  Bottom 0.254: v34.7,26.5 34.7,30.8 35.3,31.4 U1.12
X_AXIS_SPEED  (via drill 0.25)
  Top 0.254: v26.1,13.3 26.1,8.6 v26.6,8.1 | v42.3,12.1 58.5,12.1 U1.21
  Bottom 0.254: U$1.16 27.49,28.69 26.1,27.3 v26.1,13.3 | v26.6,8.1 36.5,8.1 40.4,12 42.2,12 v42.3,12.1
X_AXIS_UP  (via drill 0.25)
  Top 0.254: U$1.14 33.31,23.61 v33.9,24.2 | U1.9 35,39 34.1,38.1 v34.1,35.6
  Bottom 0.254: v33.9,24.2 33.9,25.5 33.8,25.6 33.8,27.3 34.1,27.6 v34.1,35.6
X_POS
  Top 0.254: JP7.2 9.16,20.26 11.2,22.3 35.2,22.3 U1.15
Y+
  Top 0.406: U$1.6 12.99,15.99 11.8,14.8 11.8,3.18 JP8.3
Y-
  Top 0.406: U$1.7 13.75,13.45 12.8,12.5 12.8,6.5 14.6,4.7 14.6,3.08 JP8.4
Y_AXIS_DOWN
  Bottom 0.254: U1.13 36.45,28.85 35.6,28 35.6,23.5 33.8,21.7 33.8,17.3 32.5,16 U$1.11
Y_AXIS_SPEED  (via drill 0.25)
  Top 0.254: v43.2,13.6 U1.22
  Bottom 0.254: U$1.10 34.05,13.45 35.3,14.7 42.1,14.7 v43.2,13.6
Y_AXIS_UP
  Bottom 0.254: U1.10 33.17,36.47 32.4,35.7 32.4,19.4 31.5,18.5 30.25,18.5 U$1.12
Y_POS  (via drill 0.25)
  Top 0.254: v28,13.6 28,3.4 v27.2,2.6
  Bottom 0.254: JP8.2 9.44,3.66 8.4,4.7 8.4,7.5 9.2,8.3 16.5,8.3 22.2,2.6 v27.2,2.6 | U1.16 35.33,21.23 34.7,20.6 34.7,16 33.4,14.7 29.1,14.7 v28,13.6
Z1+
  Top 0.254: JP9.2 8.5,34.3 9.4,35.2 9.4,49 11.1,50.7 14.75,50.7 U$2.4
Z1-
  Top 0.254: JP9.4 7.56,31.76 10.7,34.9 10.7,47.2 11.5,48 14.85,48 U$2.5
Z1_POS+  (via drill 0.25)
  Top 0.254: v62.4,41.6 v62.4,39.2
  Bottom 0.254: R9.P$1 62.85,45.9 R10.P$2 62.75,45.8 62.1,45.8 61.3,45 61.3,42.7 v62.4,41.6 | U1.30 60.43,33.93 61.3,34.8 61.3,38.1 v62.4,39.2
Z1_POS+_5V
  Bottom 0.254: R9.P$2 69.86,45.9 JP10.3
Z1_POS-  (via drill 0.25)
  Top 0.254: R14.P$2 70.1,55.15 R13.P$1 69.45,53.25 61.5,45.3 52.9,45.3 v52.5,44.9 | v52.5,35 52.5,28 v47.5,23 | v40.6,22.5 40.1,23 SJ1.1
  Bottom 0.254: v52.5,44.9 v52.5,35 | v47.5,23 41.1,23 v40.6,22.5
Z1_POS-_5V
  Top 0.254: JP10.1 69.9,51.35 R13.P$2
Z2+
  Bottom 0.254: JP10.2 72.2,48.4 70.9,47.1 61.8,47.1 61.3,47.6 40.5,47.6 38.2,45.3 33.9,45.3 32.7,44.1 16.27,44.1 U$2.6
Z2-  (via drill 0.25)
  Top 0.254: JP10.4 71.96,45.86 70.7,44.6 63.1,44.6 61.3,42.8 57.5,42.8 56.5,41.8 41.6,41.8 40.6,42.8 v33.5,42.8
  Bottom 0.254: v33.5,42.8 32.5,42.8 31.5,41.8 28.8,41.8 27.3,43.3 15.23,43.3 U$2.7
Z2_POS+  (via drill 0.25)
  Top 0.254: v27.5,30.1 27.5,29.8 29.9,27.4 35.3,27.4 35.7,27 35.7,25.3 36.1,24.9 37.7,24.9 38.1,24.5 38.1,21.6 38.7,21 40.2,21 v40.6,20.6 | v49.7,21.2 49.7,23.7 53.7,27.7 53.7,30.8 54.3,31.4 U1.29
  Bottom 0.254: R11.P$1 11.35,31.1 R12.P$2 26.45,31.15 v27.5,30.1 | v40.6,20.6 49.1,20.6 v49.7,21.2
Z2_POS+_5V
  Bottom 0.254: JP9.3 3.2,31.8 4.4,33 7,33 8,32 8,31.15 R11.P$2
Z2_POS-  (via drill 0.25)
  Top 0.254: R15.P$1 R16.P$2 7.35,23.45 v7.4,23.4 | v39.5,12.5 39.5,14.08 SJ2.1
  Bottom 0.254: v7.4,23.4 7.4,13.5 8.8,12.1 39.1,12.1 v39.5,12.5
Z2_POS-_5V
  Top 0.254: R15.P$2 1.8,25.8 1.3,26.3 1.3,33.8 1.8,34.3 JP9.1
Z_AXIS1_SPEED  (via drill 0.25)
  Top 0.254: v46.3,53.7 v46.3,44.7 | v54.9,21 54.9,17.5 56.2,16.2 59.48,16.2 U1.23
  Bottom 0.254: U$2.16 32.81,58.19 35.5,55.5 44.5,55.5 v46.3,53.7 | v46.3,44.7 46.3,35.3 51.4,30.2 51.4,24.5 v54.9,21
Z_AXIS2_SPEED  (via drill 0.25)
  Top 0.254: U$2.10 31.15,42.95 33.9,40.2 36.9,40.2 39.2,37.9 39.2,36 v41.7,33.5
  Bottom 0.254: v41.7,33.5 46.8,33.5 50.4,29.9 50.4,22.9 54.6,18.7 U1.24
Z_AXIS_DOWN  (via drill 0.25)
  Top 0.254: v49,44.6 49,43.6 48,42.6 41.9,42.6 39,45.5 35.7,45.5 35.2,45 30.7,45 30.2,45.5 U$2.11 | U$2.15 30.45,55.65 32.3,53.8 32.3,47.67 U$2.11 | U$2.11
  Bottom 0.254: U1.26 55.33,23.77 53.4,25.7 53.4,30.8 48.3,35.9 48.3,43.9 v49,44.6
Z_AXIS_UP  (via drill 0.25)
  Top 0.254: v47.3,43.7 47.3,49.6 v47.8,50.1 | U$2.14 30.59,53.11 31.5,52.2 31.5,48.95 30.7,48.15 30.24,48.15 U$2.12
  Bottom 0.254: U1.25 56.27,21.23 52.5,25 52.5,30.6 47.3,35.8 v47.3,43.7 | v47.8,50.1 47.4,50.5 33.7,50.5 31.35,48.15 30.24,48.15 U$2.12

### Text on the board
tPlace: TEAM C | VACOOMBA | MECHATRONIC DESIGN / 16-778/24-778/18-578 | ~#